# Altium schematic sheet S7CAS-PLEIADES-CARTE-MERE_P07_DDR.SchDoc
size Tabloid; DocumentNumber: 11; SheetNumber: 11; SheetTotal: 16; Sheet_Name: DDR; Size: 11x17
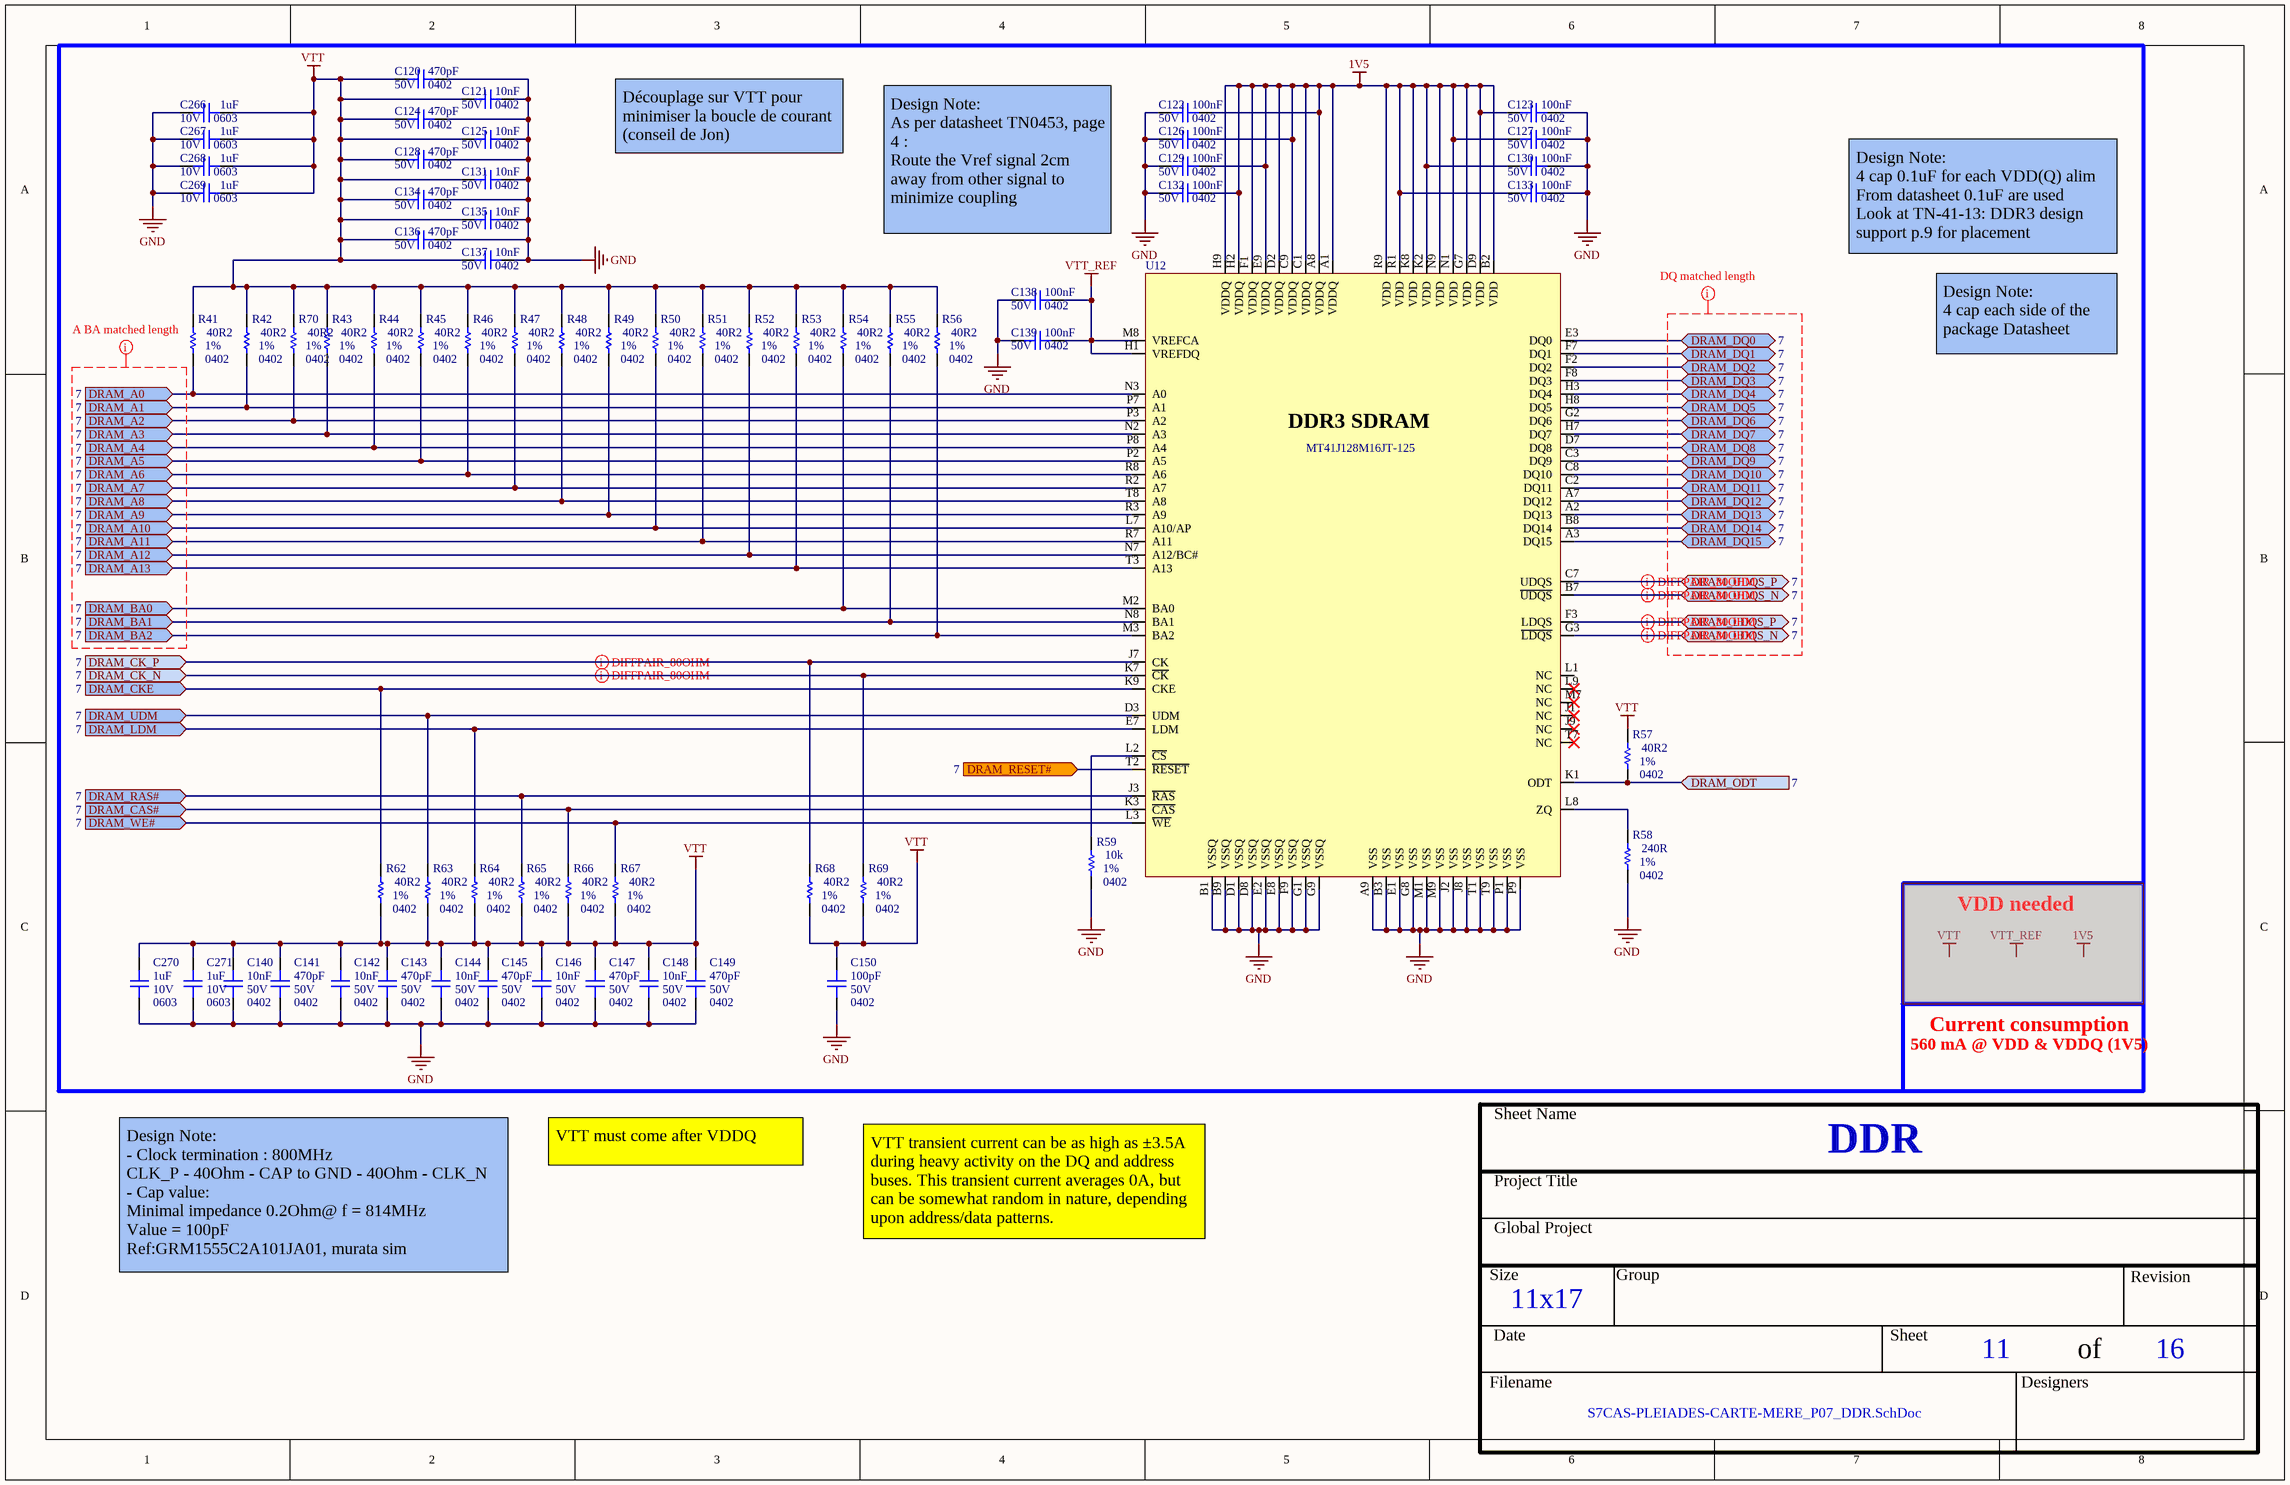
[diagram p0: S7CAS-PLEIADES-CARTE-MERE_P07_DDR.SchDoc]

## Parts
C120  value 470pF  Voltage: 50V  Package: 0402  [CAP_0402]  (hidden comment: CAP - 0402)
C121  value 10nF  Voltage: 50V  Package: 0402  [CAP_0402]  (hidden comment: CAP - 0402)
C122  value 100nF  Voltage: 50V  Package: 0402  [CAP_0402]  (hidden comment: CAP - 0402)
C123  value 100nF  Voltage: 50V  Package: 0402  [CAP_0402]  (hidden comment: CAP - 0402)
C124  value 470pF  Voltage: 50V  Package: 0402  [CAP_0402]  (hidden comment: CAP - 0402)
C125  value 10nF  Voltage: 50V  Package: 0402  [CAP_0402]  (hidden comment: CAP - 0402)
C126  value 100nF  Voltage: 50V  Package: 0402  [CAP_0402]  (hidden comment: CAP - 0402)
C127  value 100nF  Voltage: 50V  Package: 0402  [CAP_0402]  (hidden comment: CAP - 0402)
C128  value 470pF  Voltage: 50V  Package: 0402  [CAP_0402]  (hidden comment: CAP - 0402)
C129  value 100nF  Voltage: 50V  Package: 0402  [CAP_0402]  (hidden comment: CAP - 0402)
C130  value 100nF  Voltage: 50V  Package: 0402  [CAP_0402]  (hidden comment: CAP - 0402)
C131  value 10nF  Voltage: 50V  Package: 0402  [CAP_0402]  (hidden comment: CAP - 0402)
C132  value 100nF  Voltage: 50V  Package: 0402  [CAP_0402]  (hidden comment: CAP - 0402)
C133  value 100nF  Voltage: 50V  Package: 0402  [CAP_0402]  (hidden comment: CAP - 0402)
C134  value 470pF  Voltage: 50V  Package: 0402  [CAP_0402]  (hidden comment: CAP - 0402)
C135  value 10nF  Voltage: 50V  Package: 0402  [CAP_0402]  (hidden comment: CAP - 0402)
C136  value 470pF  Voltage: 50V  Package: 0402  [CAP_0402]  (hidden comment: CAP - 0402)
C137  value 10nF  Voltage: 50V  Package: 0402  [CAP_0402]  (hidden comment: CAP - 0402)
C138  value 100nF  Voltage: 50V  Package: 0402  [CAP_0402]  (hidden comment: CAP - 0402)
C139  value 100nF  Voltage: 50V  Package: 0402  [CAP_0402]  (hidden comment: CAP - 0402)
C140  value 10nF  Voltage: 50V  Package: 0402  [CAP_0402]  (hidden comment: CAP - 0402)
C141  value 470pF  Voltage: 50V  Package: 0402  [CAP_0402]  (hidden comment: CAP - 0402)
C142  value 10nF  Voltage: 50V  Package: 0402  [CAP_0402]  (hidden comment: CAP - 0402)
C143  value 470pF  Voltage: 50V  Package: 0402  [CAP_0402]  (hidden comment: CAP - 0402)
C144  value 10nF  Voltage: 50V  Package: 0402  [CAP_0402]  (hidden comment: CAP - 0402)
C145  value 470pF  Voltage: 50V  Package: 0402  [CAP_0402]  (hidden comment: CAP - 0402)
C146  value 10nF  Voltage: 50V  Package: 0402  [CAP_0402]  (hidden comment: CAP - 0402)
C147  value 470pF  Voltage: 50V  Package: 0402  [CAP_0402]  (hidden comment: CAP - 0402)
C148  value 10nF  Voltage: 50V  Package: 0402  [CAP_0402]  (hidden comment: CAP - 0402)
C149  value 470pF  Voltage: 50V  Package: 0402  [CAP_0402]  (hidden comment: CAP - 0402)
C150  value 100pF  Voltage: 50V  Package: 0402  [CAP_0402]  (hidden comment: CAP - 0402)
C266  value 1uF  Voltage: 10V  Package: 0603  [CAP_0603]  (hidden comment: CAP - 0603)
C267  value 1uF  Voltage: 10V  Package: 0603  [CAP_0603]  (hidden comment: CAP - 0603)
C268  value 1uF  Voltage: 10V  Package: 0603  [CAP_0603]  (hidden comment: CAP - 0603)
C269  value 1uF  Voltage: 10V  Package: 0603  [CAP_0603]  (hidden comment: CAP - 0603)
C270  value 1uF  Voltage: 10V  Package: 0603  [CAP_0603]  (hidden comment: CAP - 0603)
C271  value 1uF  Voltage: 10V  Package: 0603  [CAP_0603]  (hidden comment: CAP - 0603)
R41  value 40R2  Package: 0402  Precision: 1%  [RES_0402]  (hidden comment: RES - 0402)
R42  value 40R2  Package: 0402  Precision: 1%  [RES_0402]  (hidden comment: RES - 0402)
R43  value 40R2  Package: 0402  Precision: 1%  [RES_0402]  (hidden comment: RES - 0402)
R44  value 40R2  Package: 0402  Precision: 1%  [RES_0402]  (hidden comment: RES - 0402)
R45  value 40R2  Package: 0402  Precision: 1%  [RES_0402]  (hidden comment: RES - 0402)
R46  value 40R2  Package: 0402  Precision: 1%  [RES_0402]  (hidden comment: RES - 0402)
R47  value 40R2  Package: 0402  Precision: 1%  [RES_0402]  (hidden comment: RES - 0402)
R48  value 40R2  Package: 0402  Precision: 1%  [RES_0402]  (hidden comment: RES - 0402)
R49  value 40R2  Package: 0402  Precision: 1%  [RES_0402]  (hidden comment: RES - 0402)
R50  value 40R2  Package: 0402  Precision: 1%  [RES_0402]  (hidden comment: RES - 0402)
R51  value 40R2  Package: 0402  Precision: 1%  [RES_0402]  (hidden comment: RES - 0402)
R52  value 40R2  Package: 0402  Precision: 1%  [RES_0402]  (hidden comment: RES - 0402)
R53  value 40R2  Package: 0402  Precision: 1%  [RES_0402]  (hidden comment: RES - 0402)
R54  value 40R2  Package: 0402  Precision: 1%  [RES_0402]  (hidden comment: RES - 0402)
R55  value 40R2  Package: 0402  Precision: 1%  [RES_0402]  (hidden comment: RES - 0402)
R56  value 40R2  Package: 0402  Precision: 1%  [RES_0402]  (hidden comment: RES - 0402)
R57  value 40R2  Package: 0402  Precision: 1%  [RES_0402]  (hidden comment: RES - 0402)
R58  value 240R  Package: 0402  Precision: 1%  [RES_0402]  (hidden comment: RES - 0402)
R59  value 10k  Package: 0402  Precision: 1%  [RES_0402]  (hidden comment: RES - 0402)
R62  value 40R2  Package: 0402  Precision: 1%  [RES_0402]  (hidden comment: RES - 0402)
R63  value 40R2  Package: 0402  Precision: 1%  [RES_0402]  (hidden comment: RES - 0402)
R64  value 40R2  Package: 0402  Precision: 1%  [RES_0402]  (hidden comment: RES - 0402)
R65  value 40R2  Package: 0402  Precision: 1%  [RES_0402]  (hidden comment: RES - 0402)
R66  value 40R2  Package: 0402  Precision: 1%  [RES_0402]  (hidden comment: RES - 0402)
R67  value 40R2  Package: 0402  Precision: 1%  [RES_0402]  (hidden comment: RES - 0402)
R68  value 40R2  Package: 0402  Precision: 1%  [RES_0402]  (hidden comment: RES - 0402)
R69  value 40R2  Package: 0402  Precision: 1%  [RES_0402]  (hidden comment: RES - 0402)
R70  value 40R2  Package: 0402  Precision: 1%  [RES_0402]  (hidden comment: RES - 0402)
U12  MT41J128M16JT-125  [MEM_DDR3_MT41J128M16JT-125]

## Ports
DRAM_A0 (in, see 7), DRAM_A1 (in, see 7), DRAM_A2 (in, see 7), DRAM_A3 (in, see 7), DRAM_A4 (in, see 7), DRAM_A5 (in, see 7), DRAM_A6 (in, see 7), DRAM_A7 (in, see 7), DRAM_A8 (in, see 7), DRAM_A9 (in, see 7), DRAM_A10 (in, see 7), DRAM_A11 (in, see 7), DRAM_A12 (in, see 7), DRAM_A13 (in, see 7), DRAM_BA0 (in, see 7), DRAM_BA1 (in, see 7), DRAM_BA2 (in, see 7), DRAM_CAS# (in, see 7), DRAM_CK_N (in, see 7), DRAM_CK_P (in, see 7), DRAM_CKE (in, see 7), DRAM_DQ0 (bidir, see 7), DRAM_DQ1 (bidir, see 7), DRAM_DQ2 (bidir, see 7), DRAM_DQ3 (bidir, see 7), DRAM_DQ4 (bidir, see 7), DRAM_DQ5 (bidir, see 7), DRAM_DQ6 (bidir, see 7), DRAM_DQ7 (bidir, see 7), DRAM_DQ8 (bidir, see 7), DRAM_DQ9 (bidir, see 7), DRAM_DQ10 (bidir, see 7), DRAM_DQ11 (bidir, see 7), DRAM_DQ12 (bidir, see 7), DRAM_DQ13 (bidir, see 7), DRAM_DQ14 (bidir, see 7), DRAM_DQ15 (bidir, see 7), DRAM_LDM (in, see 7), DRAM_LDQS_N (bidir, see 7), DRAM_LDQS_P (bidir, see 7), DRAM_ODT (in, see 7), DRAM_RAS# (in, see 7), DRAM_RESET# (in, see 7), DRAM_UDM (in, see 7), DRAM_UDQS_N (bidir, see 7), DRAM_UDQS_P (bidir, see 7), DRAM_WE# (in, see 7)

## Nets
1V5: C122.1 C123.2 C126.1 C127.2 C129.1 C130.2 C132.1 C133.2 U12.A1(VDDQ) U12.A8(VDDQ) U12.B2(VDD) U12.C1(VDDQ) U12.C9(VDDQ) U12.D2(VDDQ) U12.D9(VDD) U12.E9(VDDQ) U12.F1(VDDQ) U12.G7(VDD) U12.H2(VDDQ) U12.H9(VDDQ) U12.K2(VDD) U12.K8(VDD) U12.N1(VDD) U12.N9(VDD) U12.R1(VDD) U12.R9(VDD)
GND: C120.1 C121.1 C122.2 C123.1 C124.1 C125.1 C126.2 C127.1 C128.1 C129.2 C130.1 C131.1 C132.2 C133.1 C134.1 C135.1 C136.1 C137.1 C138.2 C139.2 C140.1 C141.1 C142.1 C143.1 C144.1 C145.1 C146.1 C147.1 C148.1 C149.1 C150.1 C266.2 C267.2 C268.2 C269.2 C270.1 C271.1 R58.1 R59.1 U12.A9(VSS) U12.B1(VSSQ) U12.B3(VSS) U12.B9(VSSQ) U12.D1(VSSQ) U12.D8(VSSQ) U12.E1(VSS) U12.E2(VSSQ) U12.E8(VSSQ) U12.F9(VSSQ) U12.G1(VSSQ) U12.G8(VSS) U12.G9(VSSQ) U12.J2(VSS) U12.J8(VSS) U12.M1(VSS) U12.M9(VSS) U12.P1(VSS) U12.P9(VSS) U12.T1(VSS) U12.T9(VSS)
VTT: C120.2 C121.2 C124.2 C125.2 C128.2 C131.2 C134.2 C135.2 C136.2 C137.2 C140.2 C141.2 C142.2 C143.2 C144.2 C145.2 C146.2 C147.2 C148.2 C149.2 C150.2 C266.1 C267.1 C268.1 C269.1 C270.2 C271.2 R41.2 R42.2 R43.2 R44.2 R45.2 R46.2 R47.2 R48.2 R49.2 R50.2 R51.2 R52.2 R53.2 R54.2 R55.2 R56.2 R57.2 R62.1 R63.1 R64.1 R65.1 R66.1 R67.1 R68.1 R69.1 R70.2
VTT_REF: C138.1 C139.1 U12.H1(VREFDQ) U12.M8(VREFCA)
DRAM_A0: R41.1 U12.N3(A0) ; port DRAM_A0
DRAM_A1: R42.1 U12.P7(A1) ; port DRAM_A1
DRAM_A2: R70.1 U12.P3(A2) ; port DRAM_A2
DRAM_A3: R43.1 U12.N2(A3) ; port DRAM_A3
DRAM_A4: R44.1 U12.P8(A4) ; port DRAM_A4
DRAM_A5: R45.1 U12.P2(A5) ; port DRAM_A5
DRAM_A6: R46.1 U12.R8(A6) ; port DRAM_A6
DRAM_A7: R47.1 U12.R2(A7) ; port DRAM_A7
DRAM_A8: R48.1 U12.T8(A8) ; port DRAM_A8
DRAM_A9: R49.1 U12.R3(A9) ; port DRAM_A9
DRAM_A10: R50.1 U12.L7(A10/AP) ; port DRAM_A10
DRAM_A11: R51.1 U12.R7(A11) ; port DRAM_A11
DRAM_A12: R52.1 U12.N7(A12/BC#) ; port DRAM_A12
DRAM_A13: R53.1 U12.T3(A13) ; port DRAM_A13
DRAM_BA0: R54.1 U12.M2(BA0) ; port DRAM_BA0
DRAM_BA1: R55.1 U12.N8(BA1) ; port DRAM_BA1
DRAM_BA2: R56.1 U12.M3(BA2) ; port DRAM_BA2
DRAM_CAS#: R66.2 U12.K3(~{CAS}) ; port DRAM_CAS#
DRAM_CK_N: R69.2 U12.K7(~{CK}) ; port DRAM_CK_N
DRAM_CK_P: R68.2 U12.J7(CK) ; port DRAM_CK_P
DRAM_CKE: R62.2 U12.K9(CKE) ; port DRAM_CKE
DRAM_DQ0: U12.E3(DQ0) ; port DRAM_DQ0
DRAM_DQ1: U12.F7(DQ1) ; port DRAM_DQ1
DRAM_DQ2: U12.F2(DQ2) ; port DRAM_DQ2
DRAM_DQ3: U12.F8(DQ3) ; port DRAM_DQ3
DRAM_DQ4: U12.H3(DQ4) ; port DRAM_DQ4
DRAM_DQ5: U12.H8(DQ5) ; port DRAM_DQ5
DRAM_DQ6: U12.G2(DQ6) ; port DRAM_DQ6
DRAM_DQ7: U12.H7(DQ7) ; port DRAM_DQ7
DRAM_DQ8: U12.D7(DQ8) ; port DRAM_DQ8
DRAM_DQ9: U12.C3(DQ9) ; port DRAM_DQ9
DRAM_DQ10: U12.C8(DQ10) ; port DRAM_DQ10
DRAM_DQ11: U12.C2(DQ11) ; port DRAM_DQ11
DRAM_DQ12: U12.A7(DQ12) ; port DRAM_DQ12
DRAM_DQ13: U12.A2(DQ13) ; port DRAM_DQ13
DRAM_DQ14: U12.B8(DQ14) ; port DRAM_DQ14
DRAM_DQ15: U12.A3(DQ15) ; port DRAM_DQ15
DRAM_LDM: R64.2 U12.E7(LDM) ; port DRAM_LDM
DRAM_LDQS_N: U12.G3(~{LDQS}) ; port DRAM_LDQS_N
DRAM_LDQS_P: U12.F3(LDQS) ; port DRAM_LDQS_P
DRAM_ODT: R57.1 U12.K1(ODT) ; port DRAM_ODT
DRAM_RAS#: R65.2 U12.J3(~{RAS}) ; port DRAM_RAS#
DRAM_RESET#: U12.T2(~{RESET}) ; port DRAM_RESET#
DRAM_UDM: R63.2 U12.D3(UDM) ; port DRAM_UDM
DRAM_UDQS_N: U12.B7(~{UDQS}) ; port DRAM_UDQS_N
DRAM_UDQS_P: U12.C7(UDQS) ; port DRAM_UDQS_P
DRAM_WE#: R67.2 U12.L3(~{WE}) ; port DRAM_WE#
NetR58_2: R58.2 U12.L8(ZQ)
NetR59_2: R59.2 U12.L2(~{CS})

Not connected (* = marked no-connect by the designer): U12 J1(NC)* J9(NC)* L1(NC) L9(NC)* M7(NC)* T7(NC)*

## Layout directives
differential pair; differential pair class DIFF_80_OHM: DRAM_CK_N, DRAM_CK_P, DRAM_LDQS_N, DRAM_LDQS_P, DRAM_UDQS_N, DRAM_UDQS_P
rule Matched Net Lengths [Tolerance = 1mil]; net class DDR_DQ: (no net found under the mark)
rule Matched Net Lengths [Tolerance = 1mil]; net class DDR_ADDR: (no net found under the mark)

## Notes on the sheet
- Découplage sur VTT pour minimiser la boucle de courant (conseil de Jon)
- Design Note:
  As per datasheet TN0453, page 4 :
  Route the Vref signal 2cm away from other signal to minimize coupling
- Design Note:
  4 cap 0.1uF for each VDD(Q) alim
  From datasheet 0.1uF are used
  Look at TN-41-13: DDR3 design support p.9 for placement
- Design Note:
  4 cap each side of the package Datasheet
- VDD needed
- Current consumption
- 560 mA @ VDD & VDDQ (1V5)
- VTT must come after VDDQ
- VTT transient current can be as high as ±3.5A during heavy activity on the DQ and address buses. This transient current averages 0A, but can be somewhat random in nature, depending upon address/data patterns.
- Design Note:
  - Clock termination : 800MHz
  CLK_P - 40Ohm - CAP to GND - 40Ohm - CLK_N
  - Cap value:
  Minimal impedance 0.2Ohm@ f = 814MHz
  Value = 100pF
  Ref:GRM1555C2A101JA01, murata sim
- Sheet Name
- Project Title
- Global Project
- Size
- Group
- Revision
- Date
- Sheet
- of
- Filename
- Designers
- (in symbol MEM_DDR3_MT41J128M16JT-125:K TR) DDR3 SDRAM

## Library data of the parts
C120-C150 = CAP - 0402: Precision: 10%; Current: *; CreatedBy: Jonathan Bouchard; Power: *
C266-C271 = CAP - 0603: Precision: 10%; Current: *; CreatedBy: Jonathan Bouchard; Power: *
R41-R59 R62-R70 = RES - 0402: Voltage: 50V; Power: 1/16W; Current: *; CreatedBy: Jonathan Bouchard
U12 = MEM_DDR3_MT41J128M16JT-125:K TR: MEM - DDR3 SDRAM 2GBIT 800MHZ - TFBGA-96; Voltage: 1.425 V ~ 1.575 V; Mfg: Micrel; Current: *; Power: *; Mfg Part Number: http://www.micron.com/~/media/Documents/Products/Data%20Sheet/DRAM/DDR3/2Gb_DDR3_SDRAM.pdf; HelpURL: http://ww1.microchip.com/downloads/en/DeviceDoc/00002275A.pdf; CreatedBy: Jonathan Bouchard; Temperature: 0°C ~ 95°C (TC); Value: *; Precision: *; Package: TFBGA-96; Supplier 1: Digikey; Supplier Part Number 1: 557-1611-1-ND